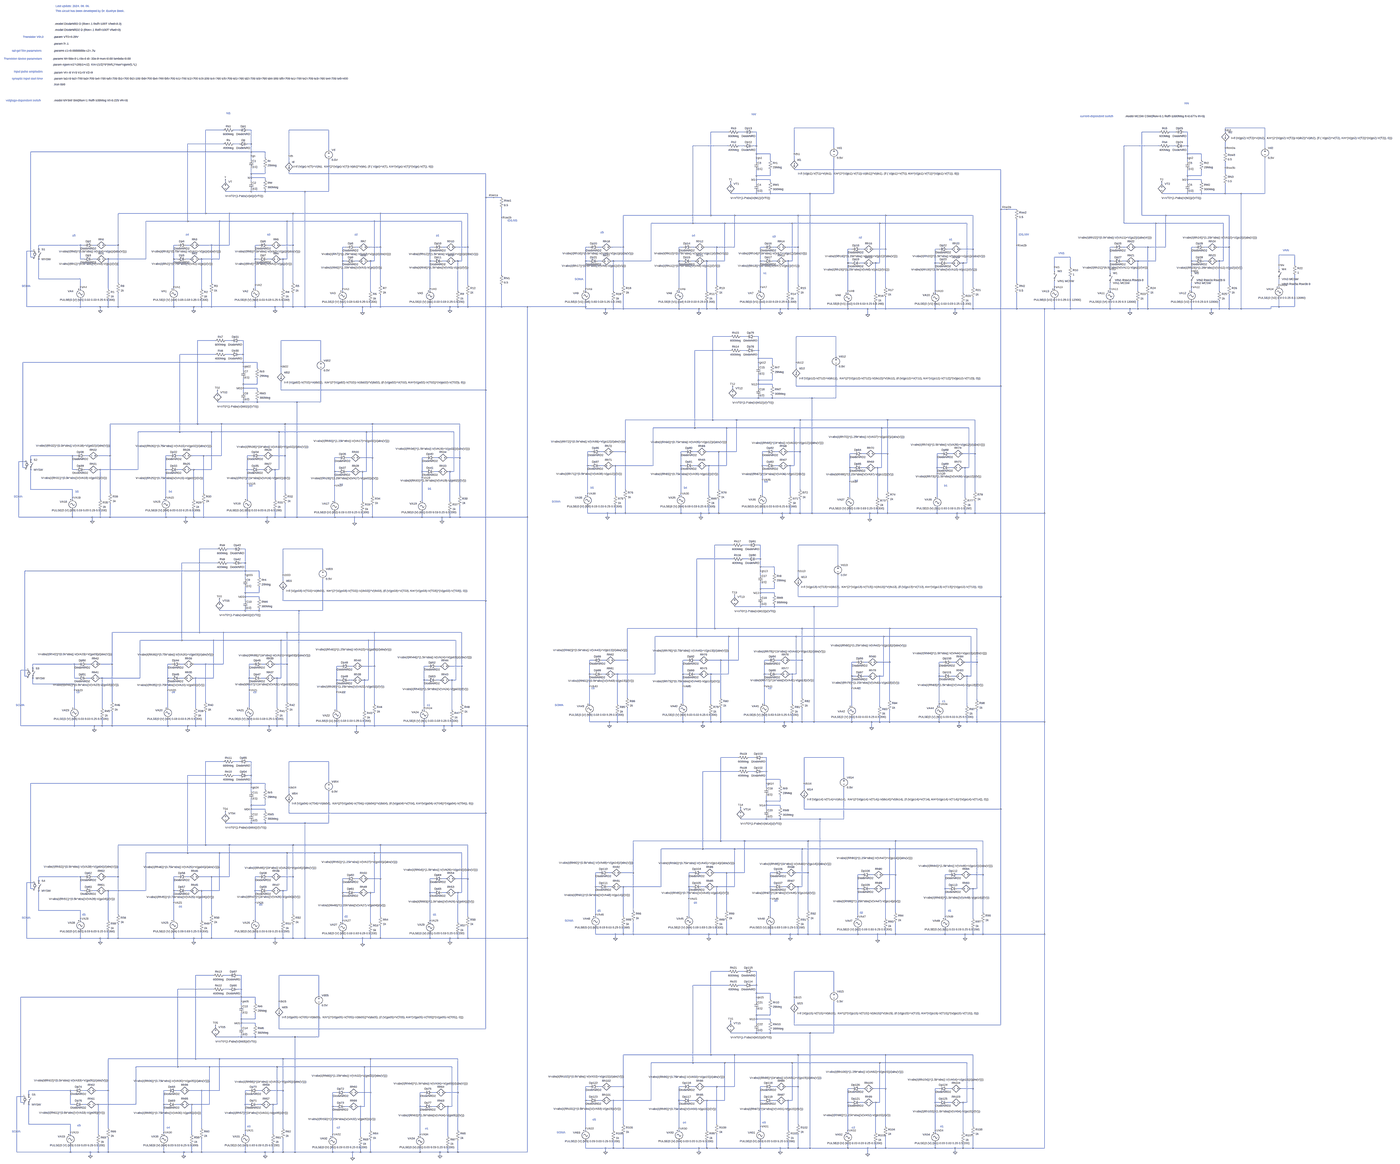
[diagram p0: schematic 2Dreceptors_NS_Baek.asc, whole sheet]
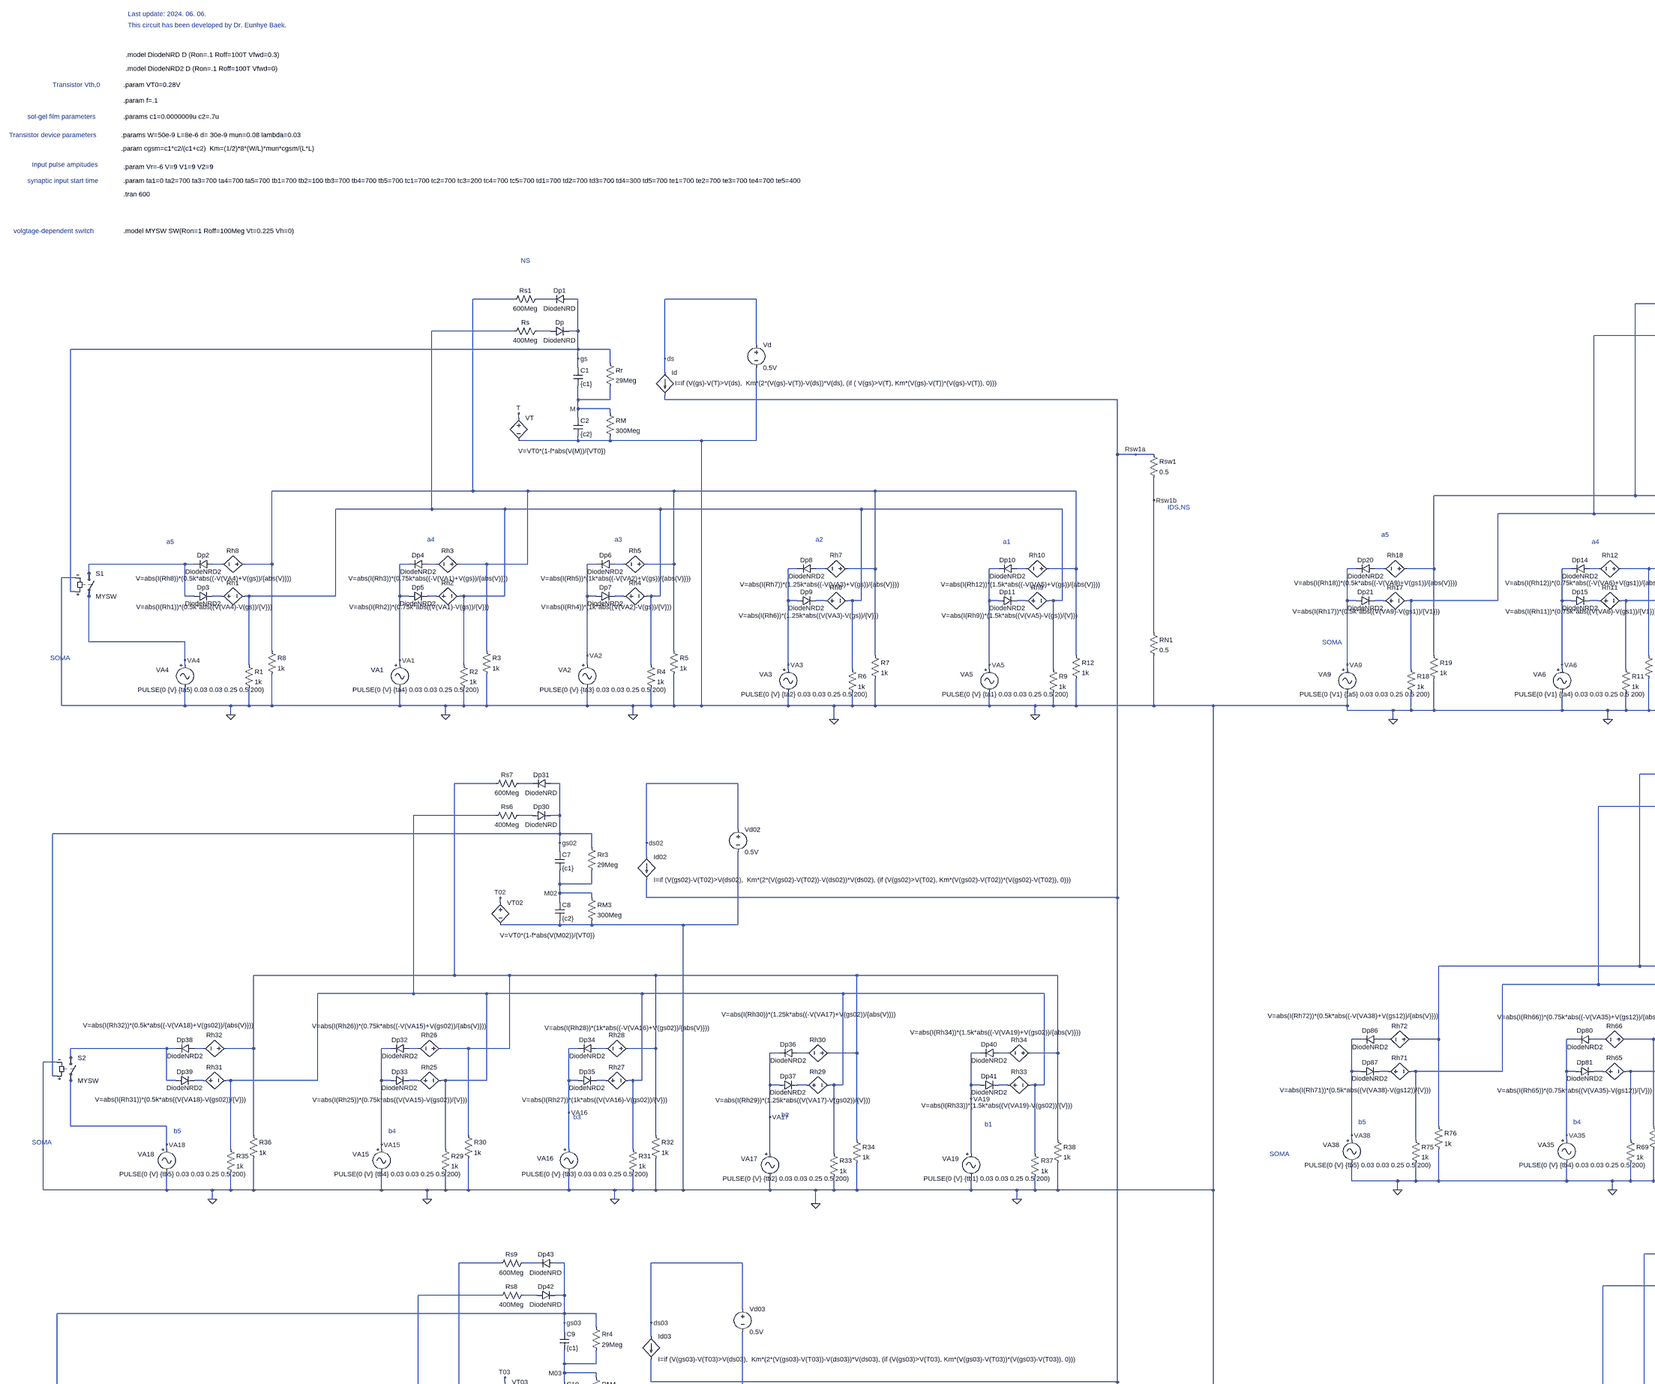
[diagram p1: schematic 2Dreceptors_NS_Baek.asc, part, row 1 of 2, column 1 of 2]
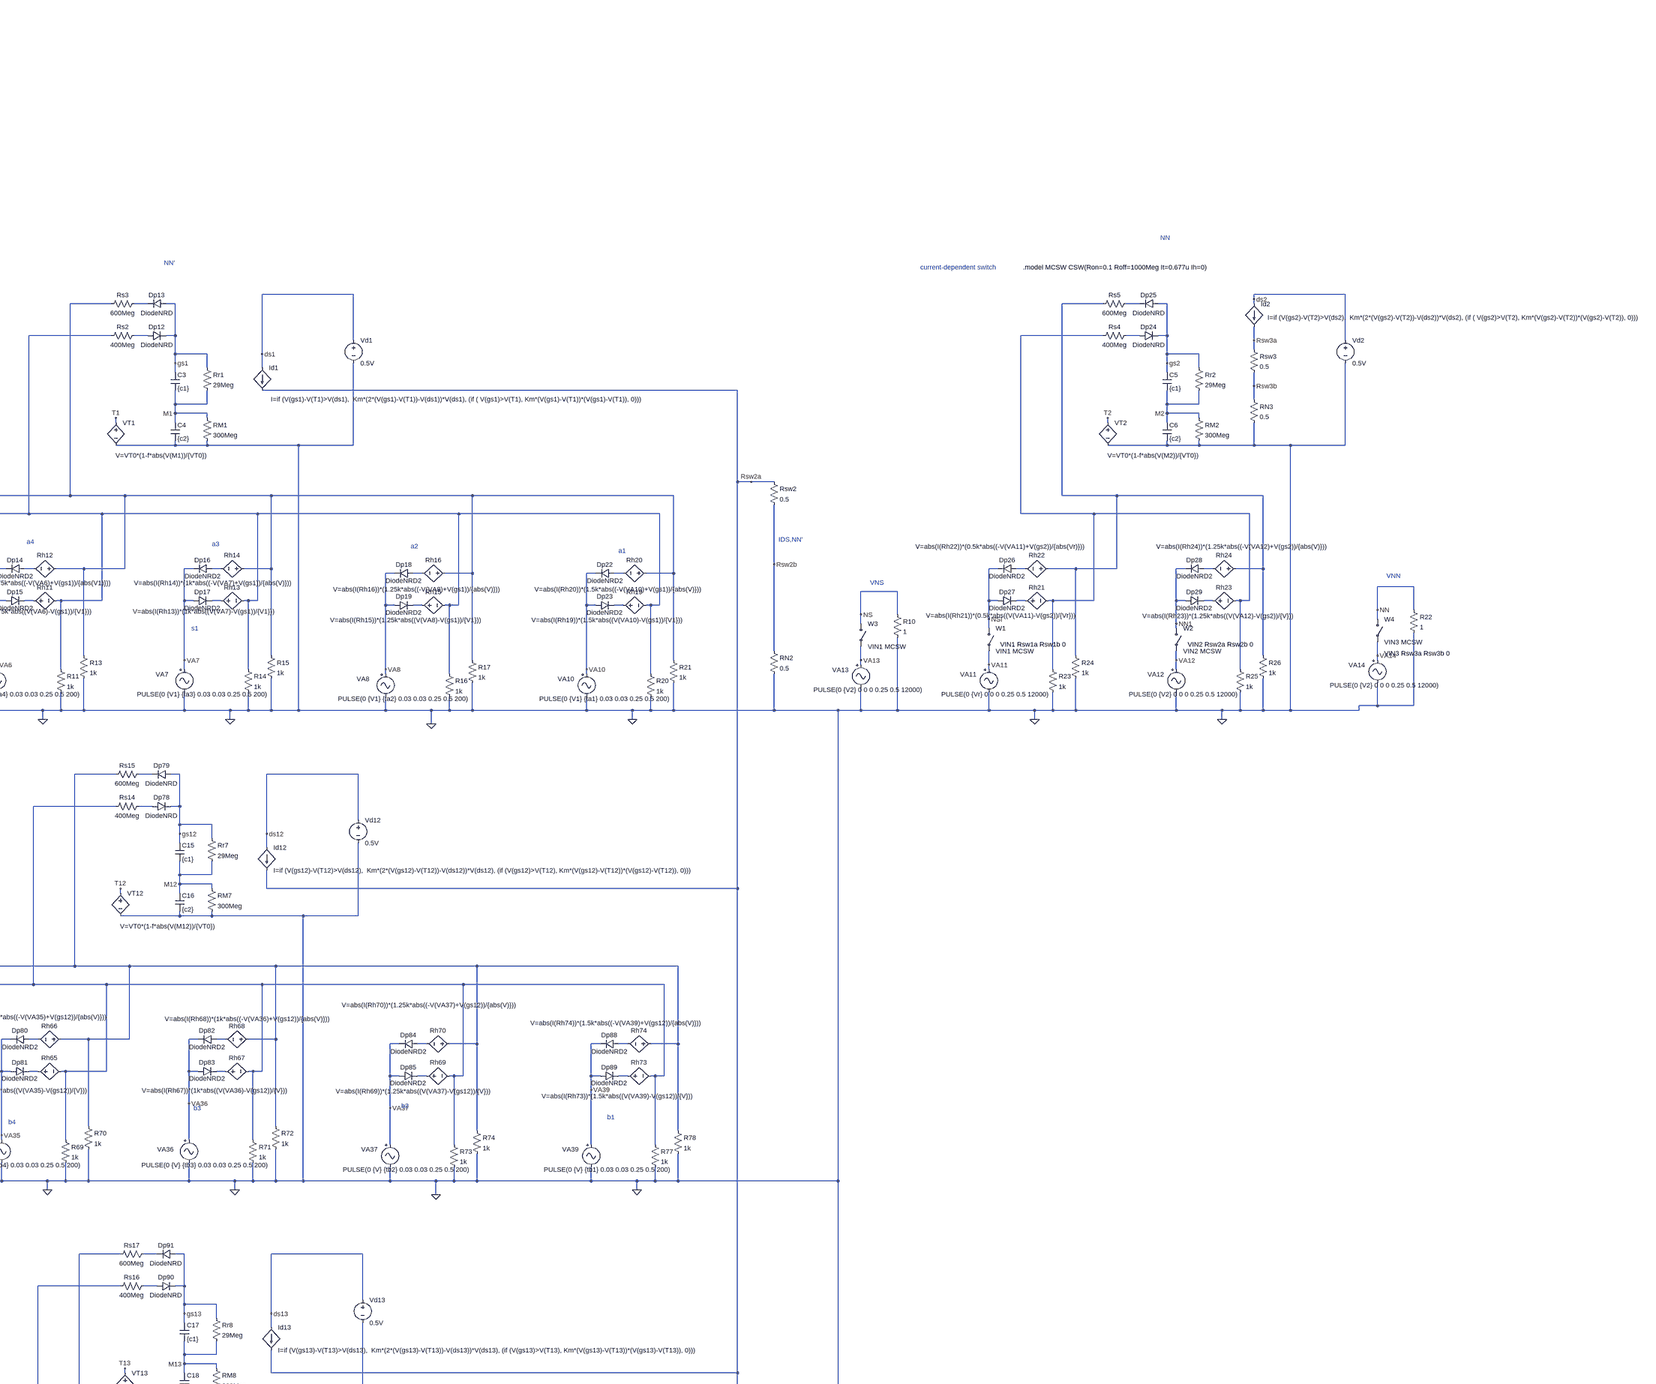
[diagram p2: schematic 2Dreceptors_NS_Baek.asc, part, row 1 of 2, column 2 of 2]
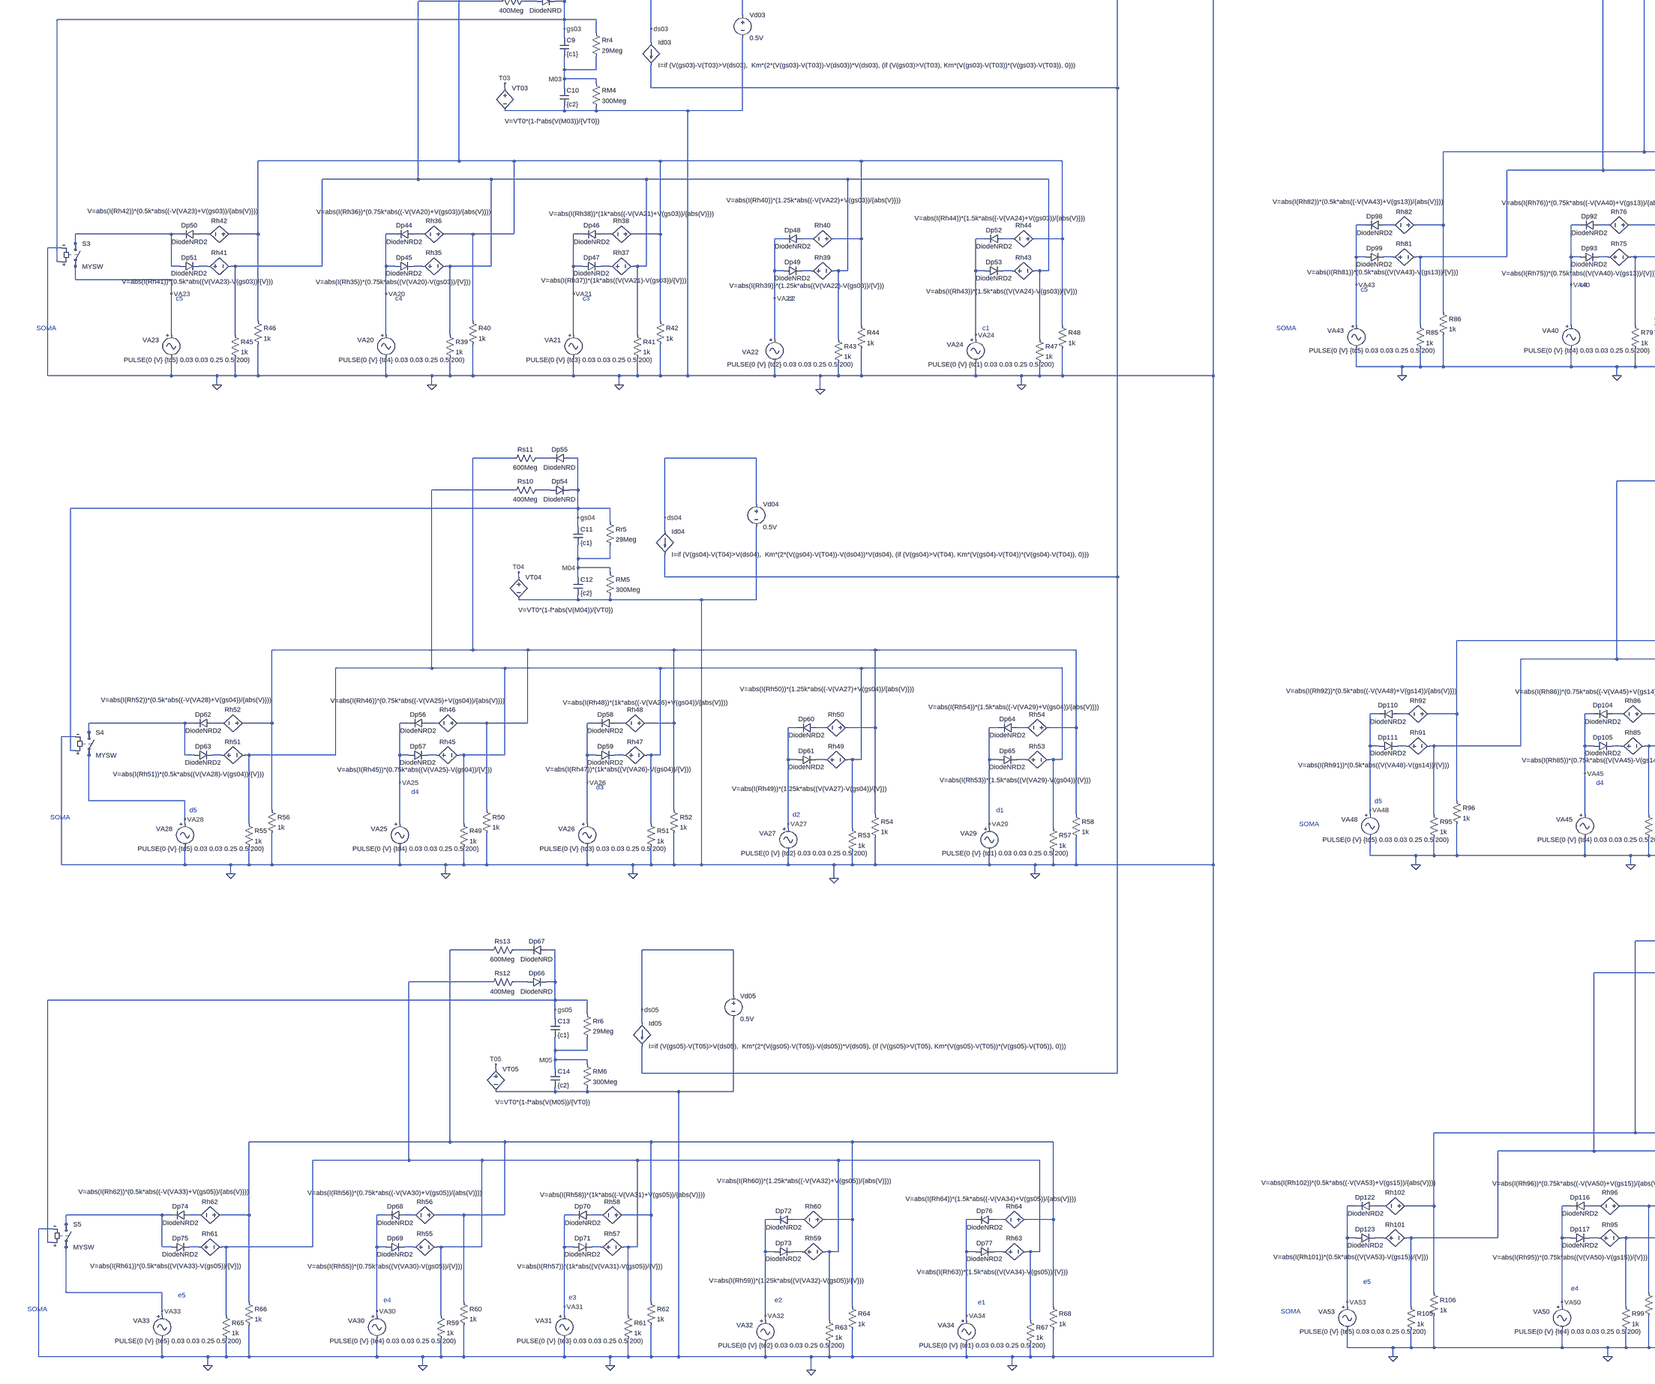
[diagram p3: schematic 2Dreceptors_NS_Baek.asc, part, row 2 of 2, column 1 of 2]
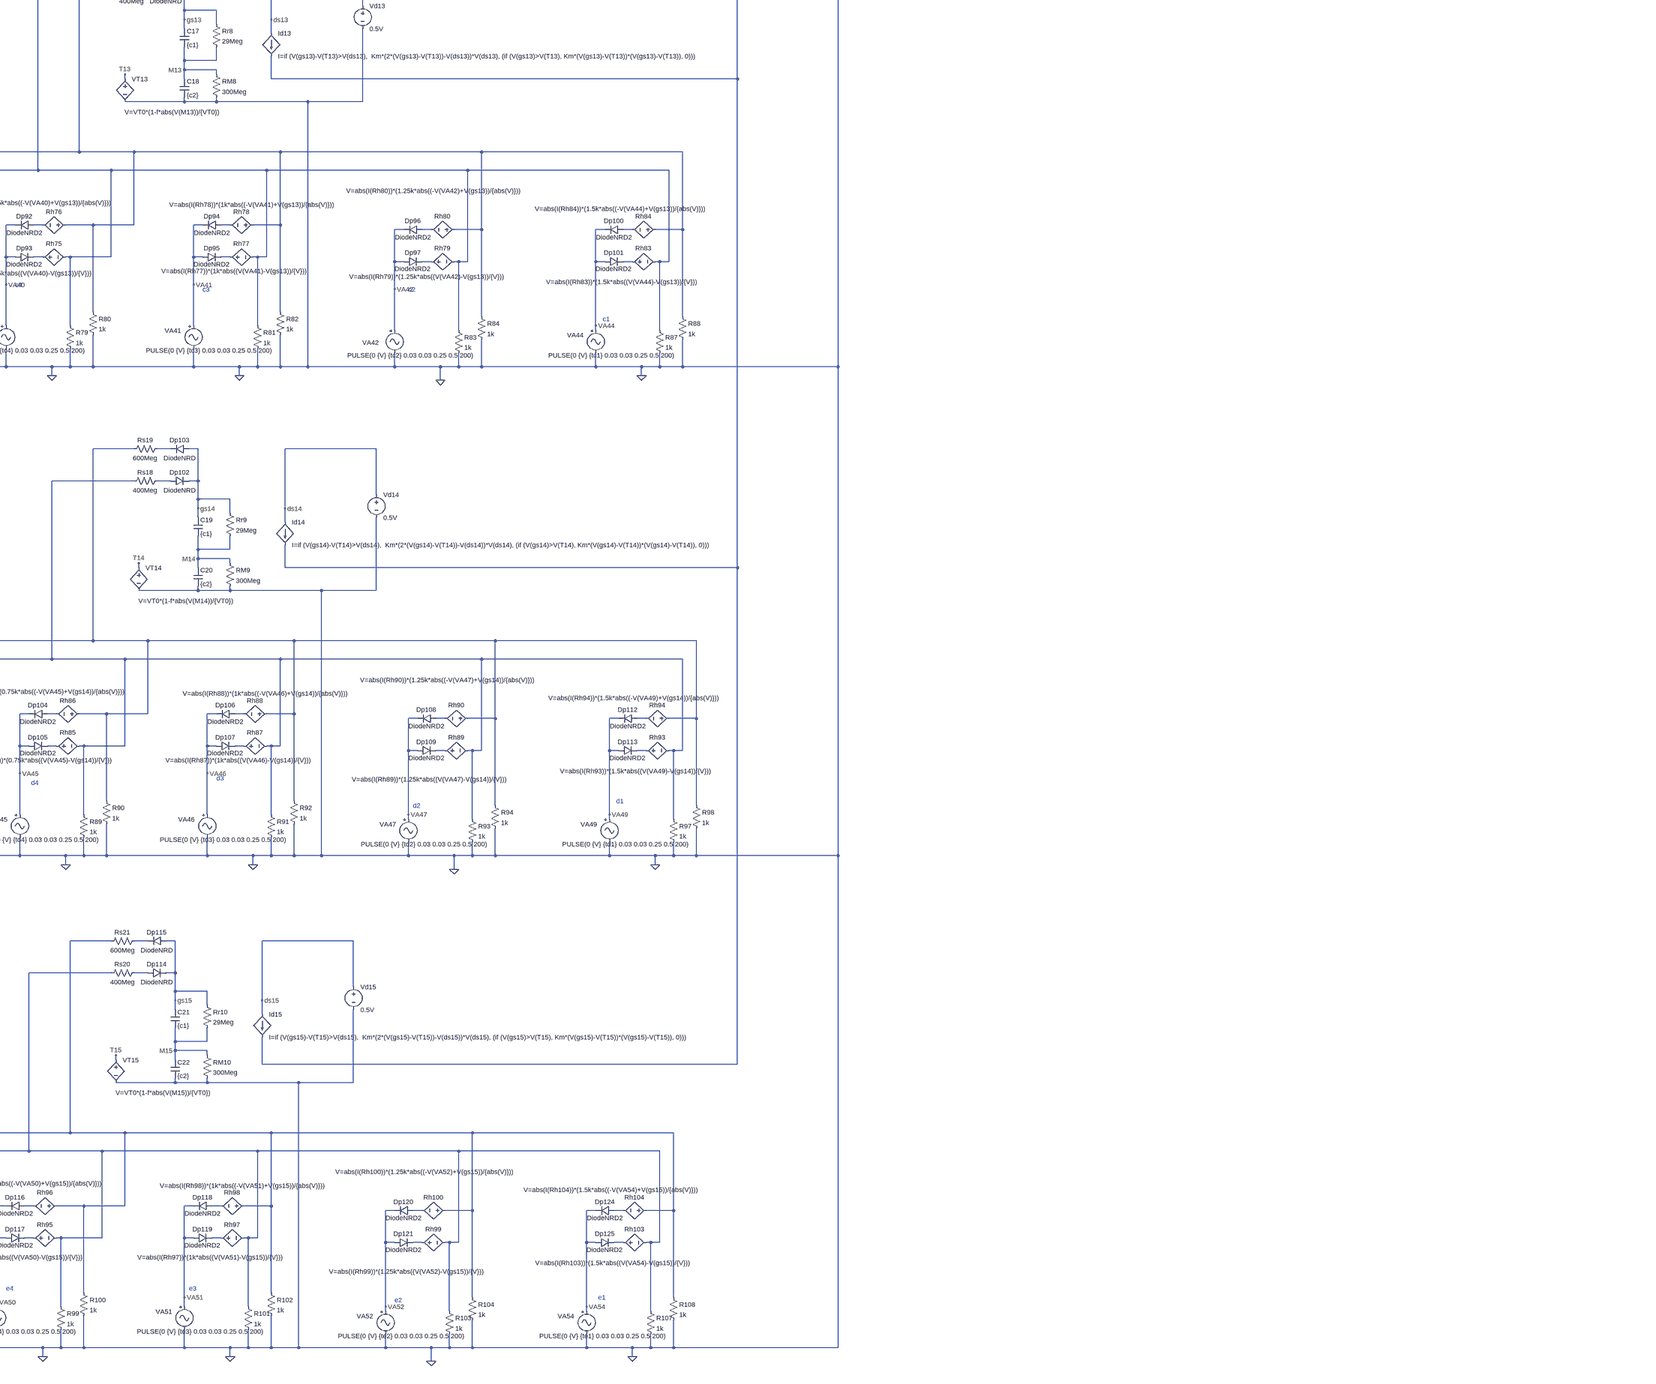
[diagram p4: schematic 2Dreceptors_NS_Baek.asc, part, row 2 of 2, column 2 of 2]
* 2Dreceptors_NS_Baek.asc
Vd ds 0 0.5V
B§Id ds Rsw1a I=if (V(gs)-V(T)>V(ds),  Km*(2*(V(gs)-V(T))-V(ds))*V(ds), (if ( V(gs)>V(T), Km*(V(gs)-V(T))*(V(gs)-V(T)), 0)))
C1 gs M {c1}
C2 M 0 {c2}
Dp N008 gs DiodeNRD
Rs N008 N007 400Meg
Rr gs M 29Meg
RM M 0 300Meg
B§VT T 0 V=VT0*(1-f*abs(V(M))/{VT0})
Dp1 gs N002 DiodeNRD
Rs1 N002 N001 600Meg
VA1 VA1 0 PULSE(0 {V} {ta4} 0.03 0.03 0.25 0.5 200)
R2 N007 0 1k
B§Rh2 N027 N007 V=abs(I(Rh2))*(0.75k*abs((V(VA1)-V(gs))/{V}))
B§Rh3 N001 N015 V=abs(I(Rh3))*(0.75k*abs((-V(VA1)+V(gs))/{abs(V)}))
Dp4 N015 VA1 DiodeNRD2
Dp5 VA1 N027 DiodeNRD2
R3 N001 0 1k
VA2 VA2 0 PULSE(0 {V} {ta3} 0.03 0.03 0.25 0.5 200)
R4 N007 0 1k
B§Rh4 N028 N007 V=abs(I(Rh4))*(1k*abs((V(VA2)-V(gs))/{V}))
B§Rh5 N001 N016 V=abs(I(Rh5))*(1k*abs((-V(VA2)+V(gs))/{abs(V)}))
Dp6 N016 VA2 DiodeNRD2
Dp7 VA2 N028 DiodeNRD2
R5 N001 0 1k
VA3 VA3 0 PULSE(0 {V} {ta2} 0.03 0.03 0.25 0.5 200)
R6 N007 0 1k
B§Rh6 N029 N007 V=abs(I(Rh6))*(1.25k*abs((V(VA3)-V(gs))/{V}))
B§Rh7 N001 N017 V=abs(I(Rh7))*(1.25k*abs((-V(VA3)+V(gs))/{abs(V)}))
Dp8 N017 VA3 DiodeNRD2
Dp9 VA3 N029 DiodeNRD2
R7 N001 0 1k
VA4 VA4 0 PULSE(0 {V} {ta5} 0.03 0.03 0.25 0.5 200)
R1 N007 0 1k
B§Rh1 N026 N007 V=abs(I(Rh1))*(0.5k*abs((V(VA4)-V(gs))/{V}))
B§Rh8 N001 N014 V=abs(I(Rh8))*(0.5k*abs((-V(VA4)+V(gs))/{abs(V)}))
Dp2 N014 N013 DiodeNRD2
Dp3 N013 N026 DiodeNRD2
R8 N001 0 1k
S1 N013 VA4 gs 0 MYSW
VA5 VA5 0 PULSE(0 {V} {ta1} 0.03 0.03 0.25 0.5 200)
R9 N007 0 1k
B§Rh9 N030 N007 V=abs(I(Rh9))*(1.5k*abs((V(VA5)-V(gs))/{V}))
B§Rh10 N001 N018 V=abs(I(Rh12))*(1.5k*abs((-V(VA5)+V(gs))/{abs(V)}))
Dp10 N018 VA5 DiodeNRD2
Dp11 VA5 N030 DiodeNRD2
R12 N001 0 1k
Vd1 ds1 0 0.5V
B§Id1 ds1 Rsw2a I=if (V(gs1)-V(T1)>V(ds1),  Km*(2*(V(gs1)-V(T1))-V(ds1))*V(ds1), (if ( V(gs1)>V(T1), Km*(V(gs1)-V(T1))*(V(gs1)-V(T1)), 0)))
C3 gs1 M1 {c1}
C4 M1 0 {c2}
Dp12 N010 gs1 DiodeNRD
Rs2 N010 N009 400Meg
Rr1 gs1 M1 29Meg
RM1 M1 0 300Meg
B§VT1 T1 0 V=VT0*(1-f*abs(V(M1))/{VT0})
Dp13 gs1 N004 DiodeNRD
Rs3 N004 N003 600Meg
VA6 VA6 0 PULSE(0 {V1} {ta4} 0.03 0.03 0.25 0.5 200)
R11 N009 0 1k
B§Rh11 N032 N009 V=abs(I(Rh11))*(0.75k*abs((V(VA6)-V(gs1))/{V1}))
B§Rh12 N003 N020 V=abs(I(Rh12))*(0.75k*abs((-V(VA6)+V(gs1))/{abs(V1)}))
Dp14 N020 VA6 DiodeNRD2
Dp15 VA6 N032 DiodeNRD2
R13 N003 0 1k
VA7 VA7 0 PULSE(0 {V1} {ta3} 0.03 0.03 0.25 0.5 200)
R14 N009 0 1k
B§Rh13 N033 N009 V=abs(I(Rh13))*(1k*abs((V(VA7)-V(gs1))/{V1}))
B§Rh14 N003 N021 V=abs(I(Rh14))*(1k*abs((-V(VA7)+V(gs1))/{abs(V)}))
Dp16 N021 VA7 DiodeNRD2
Dp17 VA7 N033 DiodeNRD2
R15 N003 0 1k
VA8 VA8 0 PULSE(0 {V1} {ta2} 0.03 0.03 0.25 0.5 200)
R16 N009 0 1k
B§Rh15 N036 N009 V=abs(I(Rh15))*(1.25k*abs((V(VA8)-V(gs1))/{V1}))
B§Rh16 N003 N024 V=abs(I(Rh16))*(1.25k*abs((-V(VA8)+V(gs1))/{abs(V)}))
Dp18 N024 VA8 DiodeNRD2
Dp19 VA8 N036 DiodeNRD2
R17 N003 0 1k
VA9 VA9 0 PULSE(0 {V1} {ta5} 0.03 0.03 0.25 0.5 200)
R18 N009 0 1k
B§Rh17 N031 N009 V=abs(I(Rh17))*(0.5k*abs((V(VA9)-V(gs1))/{V1}))
B§Rh18 N003 N019 V=abs(I(Rh18))*(0.5k*abs((-V(VA9)+V(gs1))/{abs(V)}))
Dp20 N019 VA9 DiodeNRD2
Dp21 VA9 N031 DiodeNRD2
R19 N003 0 1k
VA10 VA10 0 PULSE(0 {V1} {ta1} 0.03 0.03 0.25 0.5 200)
R20 N009 0 1k
B§Rh19 N037 N009 V=abs(I(Rh19))*(1.5k*abs((V(VA10)-V(gs1))/{V1}))
B§Rh20 N003 N025 V=abs(I(Rh20))*(1.5k*abs((-V(VA10)+V(gs1))/{abs(V)}))
Dp22 N025 VA10 DiodeNRD2
Dp23 VA10 N037 DiodeNRD2
R21 N003 0 1k
W2 NN1 VA12 VIN2 MCSW
Vd2 ds2 0 0.5V
B§Id2 ds2 Rsw3a I=if (V(gs2)-V(T2)>V(ds2),  Km*(2*(V(gs2)-V(T2))-V(ds2))*V(ds2), (if ( V(gs2)>V(T2), Km*(V(gs2)-V(T2))*(V(gs2)-V(T2)), 0)))
C5 gs2 M2 {c1}
C6 M2 0 {c2}
Dp24 N012 gs2 DiodeNRD
Rs4 N012 N011 400Meg
Rr2 gs2 M2 29Meg
RM2 M2 0 300Meg
B§VT2 T2 0 V=VT0*(1-f*abs(V(M2))/{VT0})
Dp25 gs2 N006 DiodeNRD
Rs5 N006 N005 600Meg
VA11 VA11 0 PULSE(0 {Vr} 0 0 0 0.25 0.5 12000)
R23 N011 0 1k
B§Rh21 N034 N011 V=abs(I(Rh21))*(0.5k*abs((V(VA11)-V(gs2))/{Vr}))
B§Rh22 N005 N022 V=abs(I(Rh22))*(0.5k*abs((-V(VA11)+V(gs2))/{abs(Vr)}))
Dp26 N022 NSI DiodeNRD2
Dp27 NSI N034 DiodeNRD2
R24 N005 0 1k
VA12 VA12 0 PULSE(0 {V2} 0 0 0 0.25 0.5 12000)
R25 N011 0 1k
B§Rh23 N035 N011 V=abs(I(Rh23))*(1.25k*abs((V(VA12)-V(gs2))/{V}))
B§Rh24 N005 N023 V=abs(I(Rh24))*(1.25k*abs((-V(VA12)+V(gs2))/{abs(V)}))
Dp28 N023 NN1 DiodeNRD2
Dp29 NN1 N035 DiodeNRD2
R26 N005 0 1k
W1 NSI VA11 VIN1 MCSW
Rsw3 Rsw3a Rsw3b 0.5
Vd02 ds02 0 0.5V
B§Id02 ds02 Rsw1a I=if (V(gs02)-V(T02)>V(ds02),  Km*(2*(V(gs02)-V(T02))-V(ds02))*V(ds02), (if (V(gs02)>V(T02), Km*(V(gs02)-V(T02))*(V(gs02)-V(T02)), 0)))
C7 gs02 M02 {c1}
C8 M02 0 {c2}
Dp30 N045 gs02 DiodeNRD
Rs6 N045 N044 400Meg
Rr3 gs02 M02 29Meg
RM3 M02 0 300Meg
B§VT02 T02 0 V=VT0*(1-f*abs(V(M02))/{VT0})
Dp31 gs02 N041 DiodeNRD
Rs7 N041 N040 600Meg
VA15 VA15 0 PULSE(0 {V} {tb4} 0.03 0.03 0.25 0.5 200)
R29 N044 0 1k
B§Rh25 N063 N044 V=abs(I(Rh25))*(0.75k*abs((V(VA15)-V(gs02))/{V}))
B§Rh26 N040 N053 V=abs(I(Rh26))*(0.75k*abs((-V(VA15)+V(gs02))/{abs(V)}))
Dp32 N053 VA15 DiodeNRD2
Dp33 VA15 N063 DiodeNRD2
R30 N040 0 1k
VA16 VA16 0 PULSE(0 {V} {tb3} 0.03 0.03 0.25 0.5 200)
R31 N044 0 1k
B§Rh27 N064 N044 V=abs(I(Rh27))*(1k*abs((V(VA16)-V(gs02))/{V}))
B§Rh28 N040 N054 V=abs(I(Rh28))*(1k*abs((-V(VA16)+V(gs02))/{abs(V)}))
Dp34 N054 VA16 DiodeNRD2
Dp35 VA16 N064 DiodeNRD2
R32 N040 0 1k
VA17 VA17 0 PULSE(0 {V} {tb2} 0.03 0.03 0.25 0.5 200)
R33 N044 0 1k
B§Rh29 N065 N044 V=abs(I(Rh29))*(1.25k*abs((V(VA17)-V(gs02))/{V}))
B§Rh30 N040 N055 V=abs(I(Rh30))*(1.25k*abs((-V(VA17)+V(gs02))/{abs(V)}))
Dp36 N055 VA17 DiodeNRD2
Dp37 VA17 N065 DiodeNRD2
R34 N040 0 1k
VA18 VA18 0 PULSE(0 {V} {tb5} 0.03 0.03 0.25 0.5 200)
R35 N044 0 1k
B§Rh31 N062 N044 V=abs(I(Rh31))*(0.5k*abs((V(VA18)-V(gs02))/{V}))
B§Rh32 N040 N052 V=abs(I(Rh32))*(0.5k*abs((-V(VA18)+V(gs02))/{abs(V)}))
Dp38 N052 N051 DiodeNRD2
Dp39 N051 N062 DiodeNRD2
R36 N040 0 1k
S2 N051 VA18 gs02 0 MYSW
VA19 VA19 0 PULSE(0 {V} {tb1} 0.03 0.03 0.25 0.5 200)
R37 N044 0 1k
B§Rh33 N066 N044 V=abs(I(Rh33))*(1.5k*abs((V(VA19)-V(gs02))/{V}))
B§Rh34 N040 N056 V=abs(I(Rh34))*(1.5k*abs((-V(VA19)+V(gs02))/{abs(V)}))
Dp40 N056 VA19 DiodeNRD2
Dp41 VA19 N066 DiodeNRD2
R38 N040 0 1k
Vd03 ds03 0 0.5V
B§Id03 ds03 Rsw1a I=if (V(gs03)-V(T03)>V(ds03),  Km*(2*(V(gs03)-V(T03))-V(ds03))*V(ds03), (if (V(gs03)>V(T03), Km*(V(gs03)-V(T03))*(V(gs03)-V(T03)), 0)))
C9 gs03 M03 {c1}
C10 M03 0 {c2}
Dp42 N074 gs03 DiodeNRD
Rs8 N074 N073 400Meg
Rr4 gs03 M03 29Meg
RM4 M03 0 300Meg
B§VT03 T03 0 V=VT0*(1-f*abs(V(M03))/{VT0})
Dp43 gs03 N070 DiodeNRD
Rs9 N070 N069 600Meg
VA20 VA20 0 PULSE(0 {V} {tc4} 0.03 0.03 0.25 0.5 200)
R39 N073 0 1k
B§Rh35 N092 N073 V=abs(I(Rh35))*(0.75k*abs((V(VA20)-V(gs03))/{V}))
B§Rh36 N069 N082 V=abs(I(Rh36))*(0.75k*abs((-V(VA20)+V(gs03))/{abs(V)}))
Dp44 N082 VA20 DiodeNRD2
Dp45 VA20 N092 DiodeNRD2
R40 N069 0 1k
VA21 VA21 0 PULSE(0 {V} {tc3} 0.03 0.03 0.25 0.5 200)
R41 N073 0 1k
B§Rh37 N093 N073 V=abs(I(Rh37))*(1k*abs((V(VA21)-V(gs03))/{V}))
B§Rh38 N069 N083 V=abs(I(Rh38))*(1k*abs((-V(VA21)+V(gs03))/{abs(V)}))
Dp46 N083 VA21 DiodeNRD2
Dp47 VA21 N093 DiodeNRD2
R42 N069 0 1k
VA22 VA22 0 PULSE(0 {V} {tc2} 0.03 0.03 0.25 0.5 200)
R43 N073 0 1k
B§Rh39 N094 N073 V=abs(I(Rh39))*(1.25k*abs((V(VA22)-V(gs03))/{V}))
B§Rh40 N069 N084 V=abs(I(Rh40))*(1.25k*abs((-V(VA22)+V(gs03))/{abs(V)}))
Dp48 N084 VA22 DiodeNRD2
Dp49 VA22 N094 DiodeNRD2
R44 N069 0 1k
VA23 VA23 0 PULSE(0 {V} {tc5} 0.03 0.03 0.25 0.5 200)
R45 N073 0 1k
B§Rh41 N091 N073 V=abs(I(Rh41))*(0.5k*abs((V(VA23)-V(gs03))/{V}))
B§Rh42 N069 N081 V=abs(I(Rh42))*(0.5k*abs((-V(VA23)+V(gs03))/{abs(V)}))
Dp50 N081 N080 DiodeNRD2
Dp51 N080 N091 DiodeNRD2
R46 N069 0 1k
S3 N080 VA23 gs03 0 MYSW
VA24 VA24 0 PULSE(0 {V} {tc1} 0.03 0.03 0.25 0.5 200)
R47 N073 0 1k
B§Rh43 N095 N073 V=abs(I(Rh43))*(1.5k*abs((V(VA24)-V(gs03))/{V}))
B§Rh44 N069 N085 V=abs(I(Rh44))*(1.5k*abs((-V(VA24)+V(gs03))/{abs(V)}))
Dp52 N085 VA24 DiodeNRD2
Dp53 VA24 N095 DiodeNRD2
R48 N069 0 1k
Vd04 ds04 0 0.5V
B§Id04 ds04 Rsw1a I=if (V(gs04)-V(T04)>V(ds04),  Km*(2*(V(gs04)-V(T04))-V(ds04))*V(ds04), (if (V(gs04)>V(T04), Km*(V(gs04)-V(T04))*(V(gs04)-V(T04)), 0)))
C11 gs04 M04 {c1}
C12 M04 0 {c2}
Dp54 N103 gs04 DiodeNRD
Rs10 N103 N102 400Meg
Rr5 gs04 M04 29Meg
RM5 M04 0 300Meg
B§VT04 T04 0 V=VT0*(1-f*abs(V(M04))/{VT0})
Dp55 gs04 N099 DiodeNRD
Rs11 N099 N098 600Meg
VA25 VA25 0 PULSE(0 {V} {td4} 0.03 0.03 0.25 0.5 200)
R49 N102 0 1k
B§Rh45 N121 N102 V=abs(I(Rh45))*(0.75k*abs((V(VA25)-V(gs04))/{V}))
B§Rh46 N098 N111 V=abs(I(Rh46))*(0.75k*abs((-V(VA25)+V(gs04))/{abs(V)}))
Dp56 N111 VA25 DiodeNRD2
Dp57 VA25 N121 DiodeNRD2
R50 N098 0 1k
VA26 VA26 0 PULSE(0 {V} {td3} 0.03 0.03 0.25 0.5 200)
R51 N102 0 1k
B§Rh47 N122 N102 V=abs(I(Rh47))*(1k*abs((V(VA26)-V(gs04))/{V}))
B§Rh48 N098 N112 V=abs(I(Rh48))*(1k*abs((-V(VA26)+V(gs04))/{abs(V)}))
Dp58 N112 VA26 DiodeNRD2
Dp59 VA26 N122 DiodeNRD2
R52 N098 0 1k
VA27 VA27 0 PULSE(0 {V} {td2} 0.03 0.03 0.25 0.5 200)
R53 N102 0 1k
B§Rh49 N123 N102 V=abs(I(Rh49))*(1.25k*abs((V(VA27)-V(gs04))/{V}))
B§Rh50 N098 N113 V=abs(I(Rh50))*(1.25k*abs((-V(VA27)+V(gs04))/{abs(V)}))
Dp60 N113 VA27 DiodeNRD2
Dp61 VA27 N123 DiodeNRD2
R54 N098 0 1k
VA28 VA28 0 PULSE(0 {V} {td5} 0.03 0.03 0.25 0.5 200)
R55 N102 0 1k
B§Rh51 N120 N102 V=abs(I(Rh51))*(0.5k*abs((V(VA28)-V(gs04))/{V}))
B§Rh52 N098 N110 V=abs(I(Rh52))*(0.5k*abs((-V(VA28)+V(gs04))/{abs(V)}))
Dp62 N110 N109 DiodeNRD2
Dp63 N109 N120 DiodeNRD2
R56 N098 0 1k
S4 N109 VA28 gs04 0 MYSW
VA29 VA29 0 PULSE(0 {V} {td1} 0.03 0.03 0.25 0.5 200)
R57 N102 0 1k
B§Rh53 N124 N102 V=abs(I(Rh53))*(1.5k*abs((V(VA29)-V(gs04))/{V}))
B§Rh54 N098 N114 V=abs(I(Rh54))*(1.5k*abs((-V(VA29)+V(gs04))/{abs(V)}))
Dp64 N114 VA29 DiodeNRD2
Dp65 VA29 N124 DiodeNRD2
R58 N098 0 1k
Vd05 ds05 0 0.5V
B§Id05 ds05 Rsw1a I=if (V(gs05)-V(T05)>V(ds05),  Km*(2*(V(gs05)-V(T05))-V(ds05))*V(ds05), (if (V(gs05)>V(T05), Km*(V(gs05)-V(T05))*(V(gs05)-V(T05)), 0)))
C13 gs05 M05 {c1}
C14 M05 0 {c2}
Dp66 N132 gs05 DiodeNRD
Rs12 N132 N131 400Meg
Rr6 gs05 M05 29Meg
RM6 M05 0 300Meg
B§VT05 T05 0 V=VT0*(1-f*abs(V(M05))/{VT0})
Dp67 gs05 N128 DiodeNRD
Rs13 N128 N127 600Meg
VA30 VA30 0 PULSE(0 {V} {te4} 0.03 0.03 0.25 0.5 200)
R59 N131 0 1k
B§Rh55 N150 N131 V=abs(I(Rh55))*(0.75k*abs((V(VA30)-V(gs05))/{V}))
B§Rh56 N127 N140 V=abs(I(Rh56))*(0.75k*abs((-V(VA30)+V(gs05))/{abs(V)}))
Dp68 N140 VA30 DiodeNRD2
Dp69 VA30 N150 DiodeNRD2
R60 N127 0 1k
VA31 VA31 0 PULSE(0 {V} {te3} 0.03 0.03 0.25 0.5 200)
R61 N131 0 1k
B§Rh57 N151 N131 V=abs(I(Rh57))*(1k*abs((V(VA31)-V(gs05))/{V}))
B§Rh58 N127 N141 V=abs(I(Rh58))*(1k*abs((-V(VA31)+V(gs05))/{abs(V)}))
Dp70 N141 VA31 DiodeNRD2
Dp71 VA31 N151 DiodeNRD2
R62 N127 0 1k
VA32 VA32 0 PULSE(0 {V} {te2} 0.03 0.03 0.25 0.5 200)
R63 N131 0 1k
B§Rh59 N152 N131 V=abs(I(Rh59))*(1.25k*abs((V(VA32)-V(gs05))/{V}))
B§Rh60 N127 N142 V=abs(I(Rh60))*(1.25k*abs((-V(VA32)+V(gs05))/{abs(V)}))
Dp72 N142 VA32 DiodeNRD2
Dp73 VA32 N152 DiodeNRD2
R64 N127 0 1k
VA33 VA33 0 PULSE(0 {V} {te5} 0.03 0.03 0.25 0.5 200)
R65 N131 0 1k
B§Rh61 N149 N131 V=abs(I(Rh61))*(0.5k*abs((V(VA33)-V(gs05))/{V}))
B§Rh62 N127 N139 V=abs(I(Rh62))*(0.5k*abs((-V(VA33)+V(gs05))/{abs(V)}))
Dp74 N139 N138 DiodeNRD2
Dp75 N138 N149 DiodeNRD2
R66 N127 0 1k
S5 N138 VA33 gs05 0 MYSW
VA34 VA34 0 PULSE(0 {V} {te1} 0.03 0.03 0.25 0.5 200)
R67 N131 0 1k
B§Rh63 N153 N131 V=abs(I(Rh63))*(1.5k*abs((V(VA34)-V(gs05))/{V}))
B§Rh64 N127 N143 V=abs(I(Rh64))*(1.5k*abs((-V(VA34)+V(gs05))/{abs(V)}))
Dp76 N143 VA34 DiodeNRD2
Dp77 VA34 N153 DiodeNRD2
R68 N127 0 1k
Vd12 ds12 0 0.5V
B§Id12 ds12 Rsw2a I=if (V(gs12)-V(T12)>V(ds12),  Km*(2*(V(gs12)-V(T12))-V(ds12))*V(ds12), (if (V(gs12)>V(T12), Km*(V(gs12)-V(T12))*(V(gs12)-V(T12)), 0)))
C15 gs12 M12 {c1}
C16 M12 0 {c2}
Dp78 N043 gs12 DiodeNRD
Rs14 N043 N042 400Meg
Rr7 gs12 M12 29Meg
RM7 M12 0 300Meg
B§VT12 T12 0 V=VT0*(1-f*abs(V(M12))/{VT0})
Dp79 gs12 N039 DiodeNRD
Rs15 N039 N038 600Meg
VA35 VA35 0 PULSE(0 {V} {tb4} 0.03 0.03 0.25 0.5 200)
R69 N042 0 1k
B§Rh65 N058 N042 V=abs(I(Rh65))*(0.75k*abs((V(VA35)-V(gs12))/{V}))
B§Rh66 N038 N047 V=abs(I(Rh66))*(0.75k*abs((-V(VA35)+V(gs12))/{abs(V)}))
Dp80 N047 VA35 DiodeNRD2
Dp81 VA35 N058 DiodeNRD2
R70 N038 0 1k
VA36 VA36 0 PULSE(0 {V} {tb3} 0.03 0.03 0.25 0.5 200)
R71 N042 0 1k
B§Rh67 N059 N042 V=abs(I(Rh67))*(1k*abs((V(VA36)-V(gs12))/{V}))
B§Rh68 N038 N048 V=abs(I(Rh68))*(1k*abs((-V(VA36)+V(gs12))/{abs(V)}))
Dp82 N048 VA36 DiodeNRD2
Dp83 VA36 N059 DiodeNRD2
R72 N038 0 1k
VA37 VA37 0 PULSE(0 {V} {tb2} 0.03 0.03 0.25 0.5 200)
R73 N042 0 1k
B§Rh69 N060 N042 V=abs(I(Rh69))*(1.25k*abs((V(VA37)-V(gs12))/{V}))
B§Rh70 N038 N049 V=abs(I(Rh70))*(1.25k*abs((-V(VA37)+V(gs12))/{abs(V)}))
Dp84 N049 VA37 DiodeNRD2
Dp85 VA37 N060 DiodeNRD2
R74 N038 0 1k
VA38 VA38 0 PULSE(0 {V} {tb5} 0.03 0.03 0.25 0.5 200)
R75 N042 0 1k
B§Rh71 N057 N042 V=abs(I(Rh71))*(0.5k*abs((V(VA38)-V(gs12))/{V}))
B§Rh72 N038 N046 V=abs(I(Rh72))*(0.5k*abs((-V(VA38)+V(gs12))/{abs(V)}))
Dp86 N046 VA38 DiodeNRD2
Dp87 VA38 N057 DiodeNRD2
R76 N038 0 1k
VA39 VA39 0 PULSE(0 {V} {tb1} 0.03 0.03 0.25 0.5 200)
R77 N042 0 1k
B§Rh73 N061 N042 V=abs(I(Rh73))*(1.5k*abs((V(VA39)-V(gs12))/{V}))
B§Rh74 N038 N050 V=abs(I(Rh74))*(1.5k*abs((-V(VA39)+V(gs12))/{abs(V)}))
Dp88 N050 VA39 DiodeNRD2
Dp89 VA39 N061 DiodeNRD2
R78 N038 0 1k
Vd13 ds13 0 0.5V
B§Id13 ds13 Rsw2a I=if (V(gs13)-V(T13)>V(ds13),  Km*(2*(V(gs13)-V(T13))-V(ds13))*V(ds13), (if (V(gs13)>V(T13), Km*(V(gs13)-V(T13))*(V(gs13)-V(T13)), 0)))
C17 gs13 M13 {c1}
C18 M13 0 {c2}
Dp90 N072 gs13 DiodeNRD
Rs16 N072 N071 400Meg
Rr8 gs13 M13 29Meg
RM8 M13 0 300Meg
B§VT13 T13 0 V=VT0*(1-f*abs(V(M13))/{VT0})
Dp91 gs13 N068 DiodeNRD
Rs17 N068 N067 600Meg
VA40 VA40 0 PULSE(0 {V} {tc4} 0.03 0.03 0.25 0.5 200)
R79 N071 0 1k
B§Rh75 N087 N071 V=abs(I(Rh75))*(0.75k*abs((V(VA40)-V(gs13))/{V}))
B§Rh76 N067 N076 V=abs(I(Rh76))*(0.75k*abs((-V(VA40)+V(gs13))/{abs(V)}))
Dp92 N076 VA40 DiodeNRD2
Dp93 VA40 N087 DiodeNRD2
R80 N067 0 1k
VA41 VA41 0 PULSE(0 {V} {tc3} 0.03 0.03 0.25 0.5 200)
R81 N071 0 1k
B§Rh77 N088 N071 V=abs(I(Rh77))*(1k*abs((V(VA41)-V(gs13))/{V}))
B§Rh78 N067 N077 V=abs(I(Rh78))*(1k*abs((-V(VA41)+V(gs13))/{abs(V)}))
Dp94 N077 VA41 DiodeNRD2
Dp95 VA41 N088 DiodeNRD2
R82 N067 0 1k
VA42 VA42 0 PULSE(0 {V} {tc2} 0.03 0.03 0.25 0.5 200)
R83 N071 0 1k
B§Rh79 N089 N071 V=abs(I(Rh79))*(1.25k*abs((V(VA42)-V(gs13))/{V}))
B§Rh80 N067 N078 V=abs(I(Rh80))*(1.25k*abs((-V(VA42)+V(gs13))/{abs(V)}))
Dp96 N078 VA42 DiodeNRD2
Dp97 VA42 N089 DiodeNRD2
R84 N067 0 1k
VA43 VA43 0 PULSE(0 {V} {tc5} 0.03 0.03 0.25 0.5 200)
R85 N071 0 1k
B§Rh81 N086 N071 V=abs(I(Rh81))*(0.5k*abs((V(VA43)-V(gs13))/{V}))
B§Rh82 N067 N075 V=abs(I(Rh82))*(0.5k*abs((-V(VA43)+V(gs13))/{abs(V)}))
Dp98 N075 VA43 DiodeNRD2
Dp99 VA43 N086 DiodeNRD2
R86 N067 0 1k
VA44 VA44 0 PULSE(0 {V} {tc1} 0.03 0.03 0.25 0.5 200)
R87 N071 0 1k
B§Rh83 N090 N071 V=abs(I(Rh83))*(1.5k*abs((V(VA44)-V(gs13))/{V}))
B§Rh84 N067 N079 V=abs(I(Rh84))*(1.5k*abs((-V(VA44)+V(gs13))/{abs(V)}))
Dp100 N079 VA44 DiodeNRD2
Dp101 VA44 N090 DiodeNRD2
R88 N067 0 1k
Vd14 ds14 0 0.5V
B§Id14 ds14 Rsw2a I=if (V(gs14)-V(T14)>V(ds14),  Km*(2*(V(gs14)-V(T14))-V(ds14))*V(ds14), (if (V(gs14)>V(T14), Km*(V(gs14)-V(T14))*(V(gs14)-V(T14)), 0)))
C19 gs14 M14 {c1}
C20 M14 0 {c2}
Dp102 N101 gs14 DiodeNRD
Rs18 N101 N100 400Meg
Rr9 gs14 M14 29Meg
RM9 M14 0 300Meg
B§VT14 T14 0 V=VT0*(1-f*abs(V(M14))/{VT0})
Dp103 gs14 N097 DiodeNRD
Rs19 N097 N096 600Meg
VA45 VA45 0 PULSE(0 {V} {td4} 0.03 0.03 0.25 0.5 200)
R89 N100 0 1k
B§Rh85 N116 N100 V=abs(I(Rh85))*(0.75k*abs((V(VA45)-V(gs14))/{V}))
B§Rh86 N096 N105 V=abs(I(Rh86))*(0.75k*abs((-V(VA45)+V(gs14))/{abs(V)}))
Dp104 N105 VA45 DiodeNRD2
Dp105 VA45 N116 DiodeNRD2
R90 N096 0 1k
VA46 VA46 0 PULSE(0 {V} {td3} 0.03 0.03 0.25 0.5 200)
R91 N100 0 1k
B§Rh87 N117 N100 V=abs(I(Rh87))*(1k*abs((V(VA46)-V(gs14))/{V}))
B§Rh88 N096 N106 V=abs(I(Rh88))*(1k*abs((-V(VA46)+V(gs14))/{abs(V)}))
Dp106 N106 VA46 DiodeNRD2
Dp107 VA46 N117 DiodeNRD2
R92 N096 0 1k
VA47 VA47 0 PULSE(0 {V} {td2} 0.03 0.03 0.25 0.5 200)
R93 N100 0 1k
B§Rh89 N118 N100 V=abs(I(Rh89))*(1.25k*abs((V(VA47)-V(gs14))/{V}))
B§Rh90 N096 N107 V=abs(I(Rh90))*(1.25k*abs((-V(VA47)+V(gs14))/{abs(V)}))
Dp108 N107 VA47 DiodeNRD2
Dp109 VA47 N118 DiodeNRD2
R94 N096 0 1k
VA48 VA48 0 PULSE(0 {V} {td5} 0.03 0.03 0.25 0.5 200)
R95 N100 0 1k
B§Rh91 N115 N100 V=abs(I(Rh91))*(0.5k*abs((V(VA48)-V(gs14))/{V}))
B§Rh92 N096 N104 V=abs(I(Rh92))*(0.5k*abs((-V(VA48)+V(gs14))/{abs(V)}))
Dp110 N104 VA48 DiodeNRD2
Dp111 VA48 N115 DiodeNRD2
R96 N096 0 1k
VA49 VA49 0 PULSE(0 {V} {td1} 0.03 0.03 0.25 0.5 200)
R97 N100 0 1k
B§Rh93 N119 N100 V=abs(I(Rh93))*(1.5k*abs((V(VA49)-V(gs14))/{V}))
B§Rh94 N096 N108 V=abs(I(Rh94))*(1.5k*abs((-V(VA49)+V(gs14))/{abs(V)}))
Dp112 N108 VA49 DiodeNRD2
Dp113 VA49 N119 DiodeNRD2
R98 N096 0 1k
Vd15 ds15 0 0.5V
B§Id15 ds15 Rsw2a I=if (V(gs15)-V(T15)>V(ds15),  Km*(2*(V(gs15)-V(T15))-V(ds15))*V(ds15), (if (V(gs15)>V(T15), Km*(V(gs15)-V(T15))*(V(gs15)-V(T15)), 0)))
C21 gs15 M15 {c1}
C22 M15 0 {c2}
Dp114 N130 gs15 DiodeNRD
Rs20 N130 N129 400Meg
Rr10 gs15 M15 29Meg
RM10 M15 0 300Meg
B§VT15 T15 0 V=VT0*(1-f*abs(V(M15))/{VT0})
Dp115 gs15 N126 DiodeNRD
Rs21 N126 N125 600Meg
VA50 VA50 0 PULSE(0 {V} {te4} 0.03 0.03 0.25 0.5 200)
R99 N129 0 1k
B§Rh95 N145 N129 V=abs(I(Rh95))*(0.75k*abs((V(VA50)-V(gs15))/{V}))
B§Rh96 N125 N134 V=abs(I(Rh96))*(0.75k*abs((-V(VA50)+V(gs15))/{abs(V)}))
Dp116 N134 VA50 DiodeNRD2
Dp117 VA50 N145 DiodeNRD2
R100 N125 0 1k
VA51 VA51 0 PULSE(0 {V} {te3} 0.03 0.03 0.25 0.5 200)
R101 N129 0 1k
B§Rh97 N146 N129 V=abs(I(Rh97))*(1k*abs((V(VA51)-V(gs15))/{V}))
B§Rh98 N125 N135 V=abs(I(Rh98))*(1k*abs((-V(VA51)+V(gs15))/{abs(V)}))
Dp118 N135 VA51 DiodeNRD2
Dp119 VA51 N146 DiodeNRD2
R102 N125 0 1k
VA52 VA52 0 PULSE(0 {V} {te2} 0.03 0.03 0.25 0.5 200)
R103 N129 0 1k
B§Rh99 N147 N129 V=abs(I(Rh99))*(1.25k*abs((V(VA52)-V(gs15))/{V}))
B§Rh100 N125 N136 V=abs(I(Rh100))*(1.25k*abs((-V(VA52)+V(gs15))/{abs(V)}))
Dp120 N136 VA52 DiodeNRD2
Dp121 VA52 N147 DiodeNRD2
R104 N125 0 1k
VA53 VA53 0 PULSE(0 {V} {te5} 0.03 0.03 0.25 0.5 200)
R105 N129 0 1k
B§Rh101 N144 N129 V=abs(I(Rh101))*(0.5k*abs((V(VA53)-V(gs15))/{V}))
B§Rh102 N125 N133 V=abs(I(Rh102))*(0.5k*abs((-V(VA53)+V(gs15))/{abs(V)}))
Dp122 N133 VA53 DiodeNRD2
Dp123 VA53 N144 DiodeNRD2
R106 N125 0 1k
VA54 VA54 0 PULSE(0 {V} {te1} 0.03 0.03 0.25 0.5 200)
R107 N129 0 1k
B§Rh103 N148 N129 V=abs(I(Rh103))*(1.5k*abs((V(VA54)-V(gs15))/{V}))
B§Rh104 N125 N137 V=abs(I(Rh104))*(1.5k*abs((-V(VA54)+V(gs15))/{abs(V)}))
Dp124 N137 VA54 DiodeNRD2
Dp125 VA54 N148 DiodeNRD2
R108 N125 0 1k
Rsw1 Rsw1a Rsw1b 0.5
Rsw2 Rsw2a Rsw2b 0.5
RN1 Rsw1b 0 0.5
RN2 Rsw2b 0 0.5
RN3 Rsw3b 0 0.5
VA13 VA13 0 PULSE(0 {V2} 0 0 0 0.25 0.5 12000)
W3 NS VA13 VIN1 MCSW
R10 NS 0 1
VA14 VA14 0 PULSE(0 {V2} 0 0 0 0.25 0.5 12000)
W4 NN VA14 VIN3 MCSW
R22 NN 0 1
.model D D
.lib standard.dio
.tran 600
.param Vr=-6 V=9 V1=9 V2=9
.model DiodeNRD D (Ron=.1 Roff=100T Vfwd=0.3)
.params W=50e-9 L=8e-6 d= 30e-9 mun=0.08 lambda=0.03
.param VT0=0.28V
.param cgsm=c1*c2/(c1+c2)  Km=(1/2)*8*(W/L)*mun*cgsm/(L*L)
.param f=.1
.params c1=0.0000009u c2=.7u
.model DiodeNRD2 D (Ron=.1 Roff=100T Vfwd=0)
.model MYSW SW(Ron=1 Roff=100Meg Vt=0.225 Vh=0)
* SOMA
.model MCSW CSW(Ron=0.1 Roff=1000Meg It=0.677u Ih=0)
VIN1 Rsw1a Rsw1b 0
VIN2 Rsw2a Rsw2b 0
* NS
* NN'
* NN
* SOMA
* SOMA
* SOMA
* SOMA
* SOMA
* b5
* b4
* b3
* b2
* b1
* c5
* c4
* c3
* c2
* c1
* d5
* d4
* d3
* d2
* d1
* e3
* s1
* SOMA
* SOMA
* SOMA
* SOMA
* b5
* b4
* b3
* b2
* b1
* c5
* c4
* c3
* c2
* c1
* d5
* d4
* d3
* d2
* d1
* e3
.param ta1=0 ta2=700 ta3=700 ta4=700 ta5=700 tb1=700 tb2=100 tb3=700 tb4=700 tb5=700 tc1=700 tc2=700 tc3=200 tc4=700 tc5=700 td1=700 td2=700 td3=700 td4=300 td5=700 te1=700 te2=700 te3=700 te4=700 te5=400
* e2
* e4
* e2
* e4
* a5
* a4
* a3
* a2
* a1
* a5
* a4
* a3
* a2
* a1
* e5
* e1
* e5
* e1
VIN3 Rsw3a Rsw3b 0
* Last update: 2024. 06. 06.
* This circuit has been developed by Dr. Eunhye Baek.
* Transistor Vth,0
* sol-gel film parameters
* Transistor device parameters
* Input pulse ampitudes
* synaptic input start time
* volgtage-dependent switch
* IDS,NS
* IDS,NN'
* VNS
* VNN
* current-dependent switch
.backanno
.end